# Altium schematic sheet tongxun.SchDoc
size A4
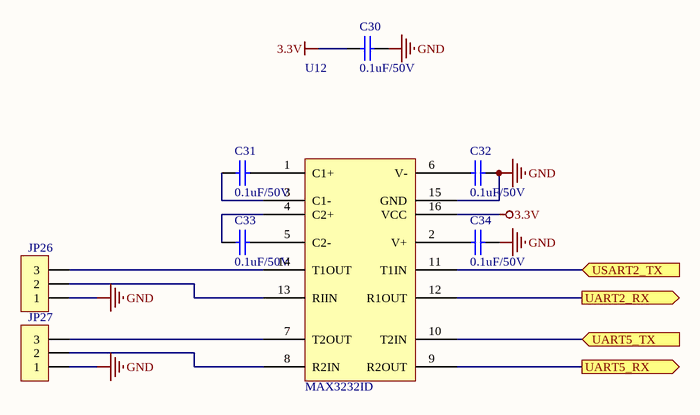
[diagram p0: tongxun.SchDoc]

## Parts
C30  0.1uF/50V  [C 0603_L]
C31  0.1uF/50V  [C 0603_L]
C32  0.1uF/50V  [C 0603_L]
C33  0.1uF/50V  [C 0603_L]
C34  0.1uF/50V  [C 0603_L]
JP26  HDR-1X3  [XH2.54-LI-3P]  (value not drawn)
JP27  HDR-1X3  [XH2.54-LI-3P]  (value not drawn)
U12  MAX3232ID  [SOP16_n]

## Ports
UART2_RX (out), UART5_RX (out), UART5_TX (in), USART2_TX (in)

## Nets
3.3V: C30.1 U12.16(VCC)
GND: C30.2 C32.2 C34.2 JP26.1 JP27.1 U12.15(GND)
UART2_RX: U12.12(R1OUT) ; port UART2_RX
UART5_RX: U12.9(R2OUT) ; port UART5_RX
UART5_TX: U12.10(T2IN) ; port UART5_TX
USART2_TX: U12.11(T1IN) ; port USART2_TX
NetC31_1: C31.1 U12.3(C1-)
NetC31_2: C31.2 U12.1(C1+)
NetC32_1: C32.1 U12.6(V-)
NetC33_1: C33.1 U12.4(C2+)
NetC33_2: C33.2 U12.5(C2-)
NetC34_1: C34.1 U12.2(V+)
NetJP26_2: JP26.2 U12.13(RIIN)
NetJP26_3: JP26.3 U12.14(T1OUT)
NetJP27_2: JP27.2 U12.8(R2IN)
NetJP27_3: JP27.3 U12.7(T2OUT)

## Library data of the parts
C30-C34 = CAP: 片式X7R电容
JP26 JP27 = Header 3: 3P接插件; 版权归属: 源创客; BOM名称: 3P接插件; 学习资源: www.ooocke.com
U12 = MAX232: 贴片集成电路